# Altium schematic sheet Driver Schematic v1.1.schdoc
size 450 x 231 mm
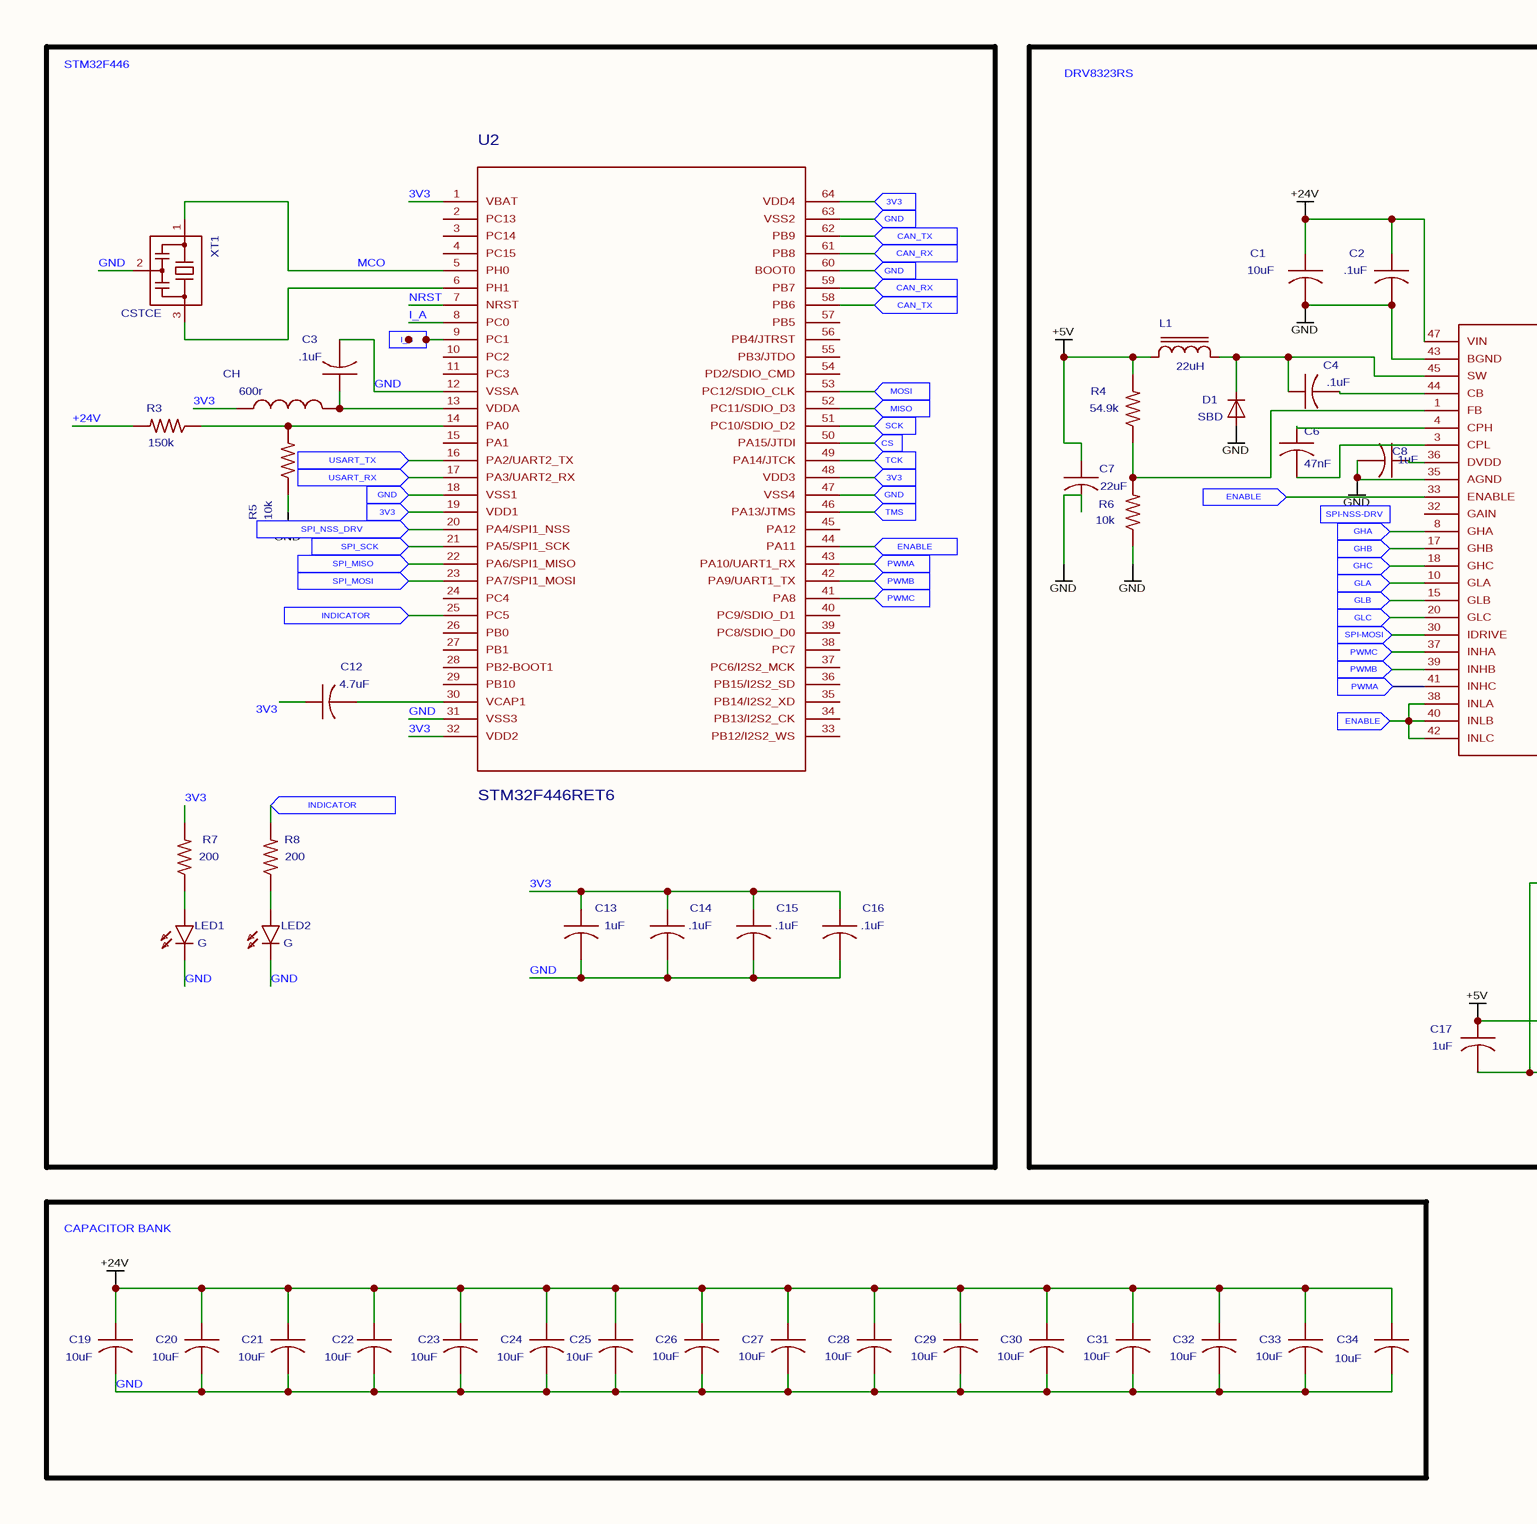
[diagram p0: Driver Schematic v1.1.schdoc, left]
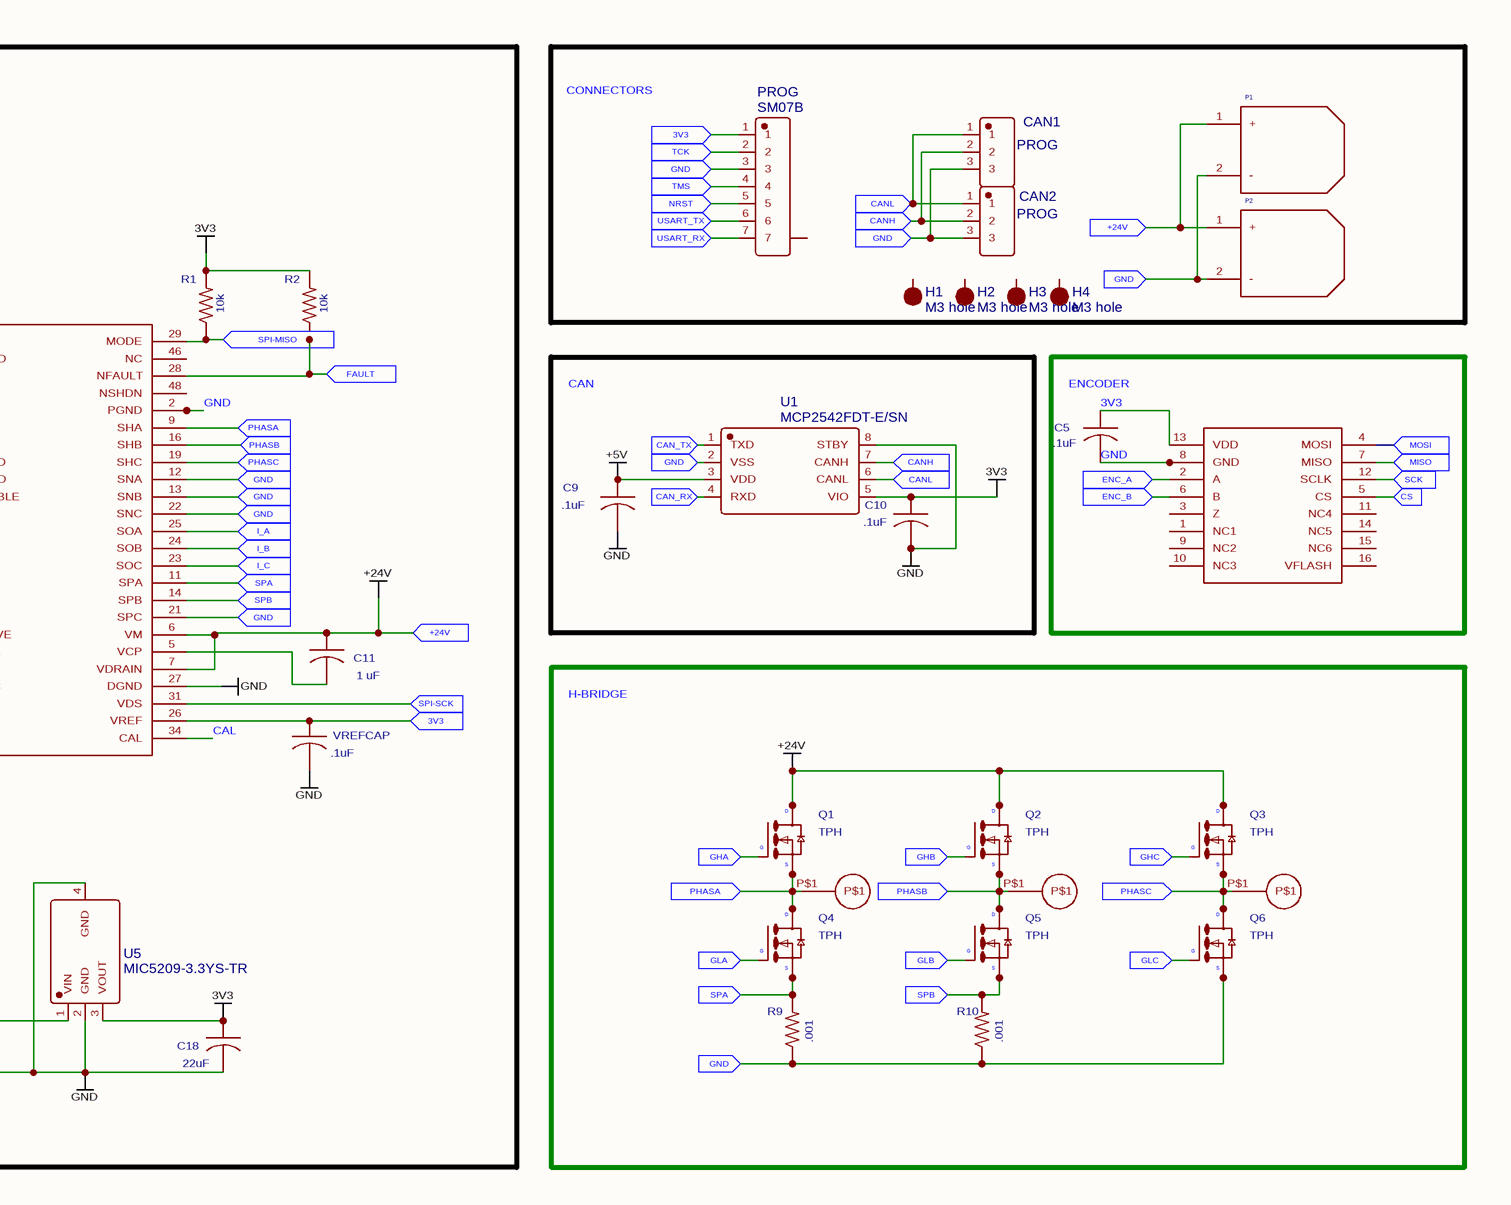
[diagram p1: Driver Schematic v1.1.schdoc, right]

## Parts
C1  10uF  [C1206]
C2  .1uF  [C0603]
C3  .1uF  [C0603]
C4  .1uF  [C0603]
C5  .1uF  [C0603]
C6  47nF  [C0603]
C7  22uF  [C0603]
C8  1uF  [C0603]
C9  .1uF  [C0603]
C10  .1uF  [C0603]
C11  1 uF  [C0603]
C12  4.7uF  [C0603]
C13  1uF  [C0603]
C14  .1uF  [C0603]
C15  .1uF  [C0603]
C16  .1uF  [C0603]
C17  1uF  [C0603]
C18  22uF  [C0603]
C19  10uF  [C1206]
C20  10uF  [C1206]
C21  10uF  [C1206]
C22  10uF  [C1206]
C23  10uF  [C1206]
C24  10uF  [C1206]
C25  10uF  [C1206]
C26  10uF  [C1206]
C27  10uF  [C1206]
C28  10uF  [C1206]
C29  10uF  [C1206]
C30  10uF  [C1206]
C31  10uF  [C1206]
C32  10uF  [C1206]
C33  10uF  [C1206]
C34  10uF  [C1206]
CAN1  PROG  [CONN-SMD_SM03B-SRSS-TB-LF-SN-P]
CAN2  PROG  [CONN-SMD_SM03B-SRSS-TB-LF-SN-P]
CH  600r  [0603]
D1  SBD  [SOD123]
H1  M3 hole  [M3 HOLE D3.6]
H2  M3 hole  [M3 HOLE D3.6]
H3  M3 hole  [M3 HOLE D3.6]
H4  M3 hole  [M3 HOLE D3.6]
L1  22uH  [IND-SMD_L3.2-W2.5]
LED1  G  [LED-0603]
LED2  G  [LED-0603]
P1  P1  [XT30PW-M]
P2  P2  [XT30PW-M]
PROG  SM07B  [CONN-SMD_SM07B-SRSS-TB]
Q1  TPH  [SOT-669_L4.9-W4.0-P1.27-LS6.0-BR]
Q2  TPH  [SOT-669_L4.9-W4.0-P1.27-LS6.0-BR]
Q3  TPH  [SOT-669_L4.9-W4.0-P1.27-LS6.0-BR]
Q4  TPH  [SOT-669_L4.9-W4.0-P1.27-LS6.0-BR]
Q5  TPH  [SOT-669_L4.9-W4.0-P1.27-LS6.0-BR]
Q6  TPH  [SOT-669_L4.9-W4.0-P1.27-LS6.0-BR]
R1  10k  [R0603]
R2  10k  [R0603]
R3  150k  [R0603]
R4  54.9k  [R0603]
R5  10k  [R0603]
R6  10k  [R0603]
R7  200  [R0603]
R8  200  [R0603]
R9  .001  [R1206]
R10  .001  [R1206]
U  18_AWG_PAD  [18_AWG_PAD]  (value not drawn)
U1  MCP2542FDT-E/SN  [SOIC-8_L4.9-W3.9-P1.27-LS6.0-BL]
U2  STM32F446RET6  [LQFP64]
U3  MA700  [QFN-16_L3.0-W3.0-P0.50-BL-EP2.0]  (value not drawn)
U4  DRV8323RH  [VQFN48G-0.5-7X7MM]  (value not drawn)
U5  MIC5209-3.3YS-TR  [SOT-223_L6.5-W3.5-P2.30-LS7.0-BR]
V  18_AWG_PAD  [18_AWG_PAD]  (value not drawn)
VREFCAP  .1uF  [C0603]
W  18_AWG_PAD  [18_AWG_PAD]  (value not drawn)
XT1  CSTCE  [OSC-SMD_3P-L3.2-W1.3-P1.2-L]

## Blocks framed on the sheet
STM32F446: C3 C12-C16 CH LED1 LED2 R3 R5 R7 R8 U2 XT1
DRV8323RS: C1 C2 C4 C6-C8 C11 C17 C18 D1 L1 R1 R2 R4 R6 U4 U5 VREFCAP
CAN: C9 C10 U1
CAPACITOR BANK: C19-C34

## Ports
3V3 (in), +24V (in), CAN_RX (in), CAN_TX (in), CANH (in), CANL (in), CS (in), ENABLE (in), ENC_A (in), ENC_B (in), FAULT (in), GHA (in), GHB (in), GHC (in), GLA (in), GLB (in), GLC (in), GND (in), I_A (in), I_B (in), I_C (in), INDICATOR (in), MISO (in), MOSI (in), NRST (in), PHASA (in), PHASB (in), PHASC (in), PWMA (in), PWMB (in), PWMC (in), SCK (in), SPA (in), SPB (in), SPI-MISO (in), SPI-MOSI (in), SPI-NSS-DRV (in), SPI-SCK (in), SPI_MISO (in), SPI_MOSI (in), SPI_NSS_DRV (in), SPI_SCK (in), TCK (in), TMS (in), USART_RX (in), USART_TX (in)

## Nets
3V3: C5.1 C10.1 C12.1 C13.1 C14.1 C15.1 C16.1 C18.1 CH.1 R1.2 R2.2 R7.2 U1.5(VIO) U2.1(VBAT) U2.32(VDD2) U3.13(VDD) U5.3(VOUT)
+5V: C7.1 C9.1 C17.1 L1.1 R4.2 U1.3(VDD) U5.1(VIN)
+24V: C1.1 C2.1 C11.1 C19.1 C20.1 C21.1 C22.1 C23.1 C24.1 C25.1 C26.1 C27.1 C28.1 C29.1 C30.1 C31.1 C32.1 C33.1 C34.1 P1.1(+) P2.1(+) Q1.5(D) Q2.5(D) Q3.5(D) R3.2 U4.6(VM) U4.7(VDRAIN) U4.47(VIN) ; port +24V
GND: C1.2 C2.2 C3.2 C5.2 C7.2 C8.2 C9.2 C10.2 C13.2 C14.2 C15.2 C16.2 C17.2 C18.2 C19.2 C20.2 C21.2 C22.2 C23.2 C24.2 C25.2 C26.2 C27.2 C28.2 C29.2 C30.2 C31.2 C32.2 C33.2 C34.2 D1.1(A) LED1.2(C) LED2.2(C) R5.1 R6.1 U1.8(STBY) U2.12(VSSA) U2.31(VSS3) U3.8(GND) U3.17(GND) U4.2(PGND) U4.27(DGND) U4.35(AGND) U4.43(BGND) U4.PAD(PGND) U5.2(GND) U5.4(GND) VREFCAP.2 XT1.2
3V3: PROG.1 U2.19(VDD1) U2.48(VDD3) U2.64(VDD4) U4.26(VREF) VREFCAP.1 ; port 3V3  [a separate net that carries the same name]
CAL: U4.34(CAL)
CAN_RX: U1.4(RXD) U2.59(PB7) U2.61(PB8) ; port CAN_RX
CAN_TX: U1.1(TXD) U2.58(PB6) U2.62(PB9) ; port CAN_TX
CANH: CAN1.2 CAN2.2 U1.7(CANH) ; port CANH
CANL: CAN1.1 CAN2.1 U1.6(CANL) ; port CANL
CS: U2.50(PA15/JTDI) U3.5(CS) ; port CS
ENABLE: U2.44(PA11) U4.33(ENABLE) U4.38(INLA) U4.40(INLB) U4.42(INLC) ; port ENABLE
ENC_A: U3.2(A) ; port ENC_A
ENC_B: U3.6(B) ; port ENC_B
FAULT: R2.1 U4.28(NFAULT) ; port FAULT
GHA: Q1.4(G) U4.8(GHA) ; port GHA
GHB: Q2.4(G) U4.17(GHB) ; port GHB
GHC: Q3.4(G) U4.18(GHC) ; port GHC
GLA: Q4.4(G) U4.10(GLA) ; port GLA
GLB: Q5.4(G) U4.15(GLB) ; port GLB
GLC: Q6.4(G) U4.20(GLC) ; port GLC
GND: CAN1.3 CAN2.3 P1.2(-) P2.2(-) PROG.3 Q6.1(S) Q6.2(S) Q6.3(S) R9.1 R10.1 U1.2(VSS) U2.18(VSS1) U2.47(VSS4) U2.60(BOOT0) U2.63(VSS2) U4.12(SNA) U4.13(SNB) U4.21(SPC) U4.22(SNC) ; port GND  [a separate net that carries the same name]
I_A: U4.25(SOA) ; port I_A
I_A: U2.8(PC0)  [a separate net that carries the same name]
I_B: U2.9(PC1) U4.24(SOB) ; port I_B
I_C: U4.23(SOC) ; port I_C
INDICATOR: R8.2 U2.25(PC5) ; port INDICATOR
MCO: U2.5(PH0) XT1.1
MISO: U2.52(PC11/SDIO_D3) U3.7(MISO) ; port MISO
MOSI: U2.53(PC12/SDIO_CLK) U3.4(MOSI) ; port MOSI
NRST: U2.7(NRST)
NRST: PROG.5 ; port NRST  [a separate net that carries the same name]
PHASA: Q1.1(S) Q1.2(S) Q1.3(S) Q4.5(D) U.P$1 U4.9(SHA) ; port PHASA
PHASB: Q2.1(S) Q2.2(S) Q2.3(S) Q5.5(D) U4.16(SHB) V.P$1 ; port PHASB
PHASC: Q3.1(S) Q3.2(S) Q3.3(S) Q6.5(D) U4.19(SHC) W.P$1 ; port PHASC
PWMA: U2.43(PA10/UART1_RX) U4.41(INHC) ; port PWMA
PWMB: U2.42(PA9/UART1_TX) U4.39(INHB) ; port PWMB
PWMC: U2.41(PA8) U4.37(INHA) ; port PWMC
SCK: U2.51(PC10/SDIO_D2) U3.12(SCLK) ; port SCK
SPA: Q4.1(S) Q4.2(S) Q4.3(S) R9.2 U4.11(SPA) ; port SPA
SPB: Q5.1(S) Q5.2(S) Q5.3(S) R10.2 U4.14(SPB) ; port SPB
SPI-MISO: R1.1 U4.29(MODE) ; port SPI-MISO
SPI-MOSI: U4.30(IDRIVE) ; port SPI-MOSI
SPI-SCK: U4.31(VDS) ; port SPI-SCK
SPI_MISO: U2.22(PA6/SPI1_MISO) ; port SPI_MISO
SPI_MOSI: U2.23(PA7/SPI1_MOSI) ; port SPI_MOSI
SPI_NSS_DRV: U2.20(PA4/SPI1_NSS) ; port SPI_NSS_DRV
SPI_SCK: U2.21(PA5/SPI1_SCK) ; port SPI_SCK
TCK: PROG.2 U2.49(PA14/JTCK) ; port TCK
TMS: PROG.4 U2.46(PA13/JTMS) ; port TMS
USART_RX: PROG.7 U2.17(PA3/UART2_RX) ; port USART_RX
USART_TX: PROG.6 U2.16(PA2/UART2_TX) ; port USART_TX
NetC3_1: C3.1 CH.2 U2.13(VDDA)
NetC4_1: C4.1 D1.2(C) L1.2 U4.45(SW)
NetC4_2: C4.2 U4.44(CB)
NetC6_1: C6.1 U4.4(CPH)
NetC6_2: C6.2 U4.3(CPL)
NetC8_1: C8.1 U4.36(DVDD)
NetC11_2: C11.2 U4.5(VCP)
NetC12_2: C12.2 U2.30(VCAP1)
NetLED1_1: LED1.1(A) R7.1
NetLED2_1: LED2.1(A) R8.1
NetR3_1: R3.1 R5.2 U2.14(PA0)
NetR4_1: R4.1 R6.2 U4.1(FB)
NetU2_6: U2.6(PH1) XT1.3

Not connected (* = marked no-connect by the designer): H1 1; H2 1; H3 1; H4 1; PROG 0; U2 2(PC13) 3(PC14) 4(PC15) 10(PC2) 11(PC3) 15(PA1) 24(PC4) 26(PB0) 27(PB1) 28(PB2-BOOT1) 29(PB10) 33(PB12/I2S2_WS) 34(PB13/I2S2_CK) 35(PB14/I2S2_XD) 36(PB15/I2S2_SD) 37(PC6/I2S2_MCK) 38(PC7) 39(PC8/SDIO_D0) 40(PC9/SDIO_D1) 45(PA12) 54(PD2/SDIO_CMD) 55(PB3/JTDO) 56(PB4/JTRST) 57(PB5); U3 1(NC1) 3(Z) 9(NC2) 10(NC3) 11(NC4) 14(NC5) 15(NC6) 16(VFLASH); U4 32(GAIN) 46(NC) 48(NSHDN)

## Notes on the sheet
- CONNECTORS
- (near C5) ENCODER
- H-BRIDGE

## Library data of the parts
CAN1 CAN2 = PROG: BOM_Manufacturer: JST; BOM_Manufacturer Part: SM04B-SRSS-TB(LF)(SN); Contributor: Gabriel Nalin Bettanin; BOM_Supplier: Digi-Key; BOM_Supplier Part: 455-1804-1-ND; spicePre: J; spiceSymbolName: JST-SH-3 correct
H1-H4 = M3 hole: Contributor: padrone; BOM_Supplier Part: x; spicePre: H; spiceSymbolName: M3 hole
P2 = P2: Package Display: No
PROG = SM07B: BOM_Manufacturer: JST Sales America; BOM_Manufacturer Part: SM07B-SRSS-TB(LF)(SN); Contributor: LCSC; BOM_Supplier: LCSC; BOM_Supplier Part: C160406; BOM_JLCPCB Part Class: Extended Part; spicePre: C; spiceSymbolName: SM07B-SRSS-TB(LF)(SN)
U1 = MCP2542FDT-E/SN: BOM_Manufacturer: Microchip Tech; Contributor: LCSC; BOM_Supplier: LCSC; BOM_Supplier Part: C191251; BOM_Manufacturer Part: MCP2542FDT-E/SN; spicePre: U; spiceSymbolName: MCP2542FDT-E/SN
U5 = MIC5209-3.3YS-TR: BOM_Manufacturer: MICROCHIP; Contributor: LCSC; SMT Type: Extend; BOM_Assembly Type: smtWeld; BOM_Paste Type: expand; BOM_Supplier: LCSC; BOM_Manufacturer Part: MIC5209-3.3YS-TR; BOM_Supplier Part: C144220; BOM_JLCPCB SMD: Yes; BOM_LCSC Assembly: Yes; spicePre: U; spiceSymbolName: MIC5209-3.3YS-TR